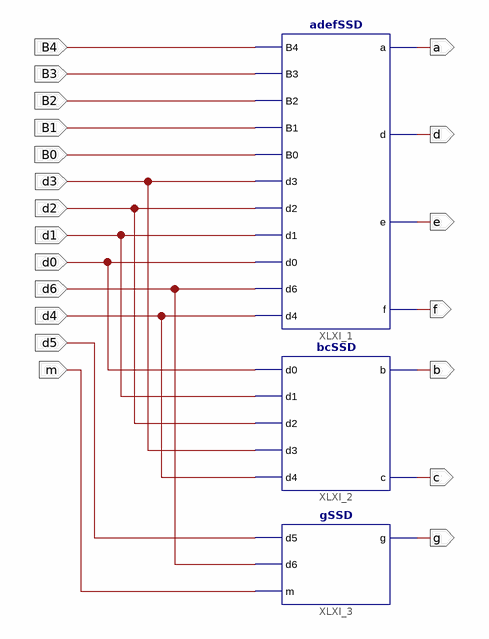
[diagram p0: schematic sheet 1]
// Xilinx ISE schematic topLvlSSD.sch (xc9500xl) as structural Verilog: 3 symbols, 20 ports
module topLvlSSD (
  input  B4,
  input  B3,
  input  B2,
  input  B1,
  input  B0,
  input  d3,
  input  d2,
  input  d1,
  input  d0,
  input  d6,
  input  d4,
  input  m,
  input  d5,
  output a,
  output d,
  output e,
  output f,
  output b,
  output c,
  output g
);

  adefSSD XLXI_1 (
    .B4(B4), .B3(B3), .B2(B2), .B1(B1), .B0(B0), .d3(d3), .d2(d2), .d1(d1), .d0(d0), .d6(d6), .d4(d4), .a(a),
    .d(d), .e(e), .f(f));
  bcSSD XLXI_2 (.d0(d0), .d1(d1), .d2(d2), .d3(d3), .d4(d4), .b(b), .c(c));
  gSSD XLXI_3 (.d5(d5), .d6(d6), .m(m), .g(g));
endmodule
